# Altium project STM32开发板.PrjPcb
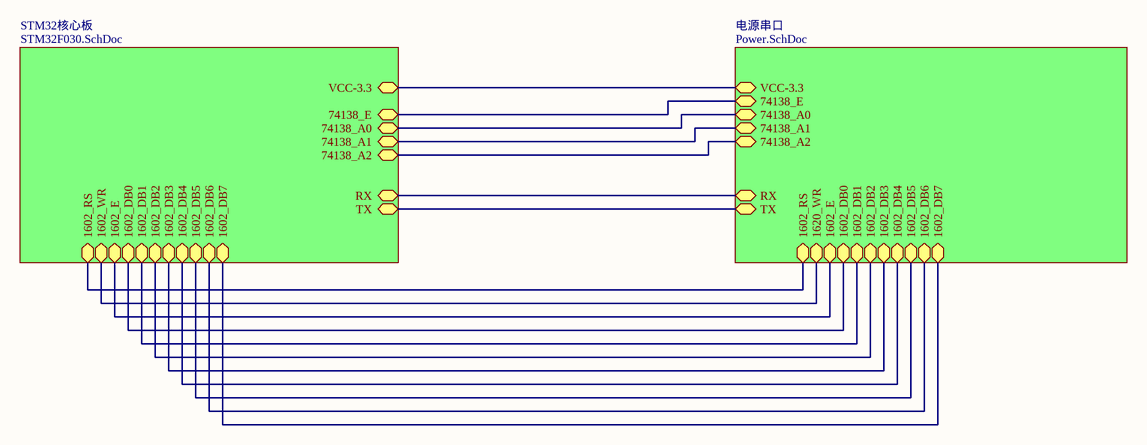
[diagram p0: STM32开发板.SchDoc]
3 sheets, 57 parts. Net scope: hierarchical (ports join the sheet entries above them; power ports are global).
Board file: STM32F030.PcbDoc
Sheets:
  STM32开发板.SchDoc
    STM32核心板 = STM32F030.SchDoc
    电源串口 = Power.SchDoc

## Sheet STM32开发板.SchDoc
size A4

### Sub-sheets
STM32核心板 = STM32F030.SchDoc: VCC-3.3, 74138_E, 74138_A0, 74138_A1, 74138_A2, 1602_RS, 1602_WR, 1602_DB0, 1602_DB1, 1602_DB2, 1602_DB4, 1602_DB5, 1602_DB6, 1602_DB3, 1602_E, 1602_DB7, RX, TX
电源串口 = Power.SchDoc: VCC-3.3, 74138_E, 74138_A0, 74138_A1, 74138_A2, 1602_RS, 1620_WR, 1602_E, 1602_DB0, 1602_DB1, 1602_DB2, 1602_DB3, 1602_DB4, 1602_DB5, 1602_DB6, 1602_DB7, RX, TX

### Nets
MCU_38_A0: sheet STM32核心板/74138_A0, sheet 电源串口/74138_A0
MCU_38_A1: sheet STM32核心板/74138_A1, sheet 电源串口/74138_A1
MCU_38_A2: sheet STM32核心板/74138_A2, sheet 电源串口/74138_A2
MCU_38_E: sheet STM32核心板/74138_E, sheet 电源串口/74138_E
MCU_LCD_DB0: sheet STM32核心板/1602_DB0, sheet 电源串口/1602_DB0
MCU_LCD_DB1: sheet STM32核心板/1602_DB1, sheet 电源串口/1602_DB1
MCU_LCD_DB2: sheet STM32核心板/1602_DB2, sheet 电源串口/1602_DB2
MCU_LCD_DB3: sheet STM32核心板/1602_DB3, sheet 电源串口/1602_DB3
MCU_LCD_DB4: sheet STM32核心板/1602_DB4, sheet 电源串口/1602_DB4
MCU_LCD_DB5: sheet STM32核心板/1602_DB5, sheet 电源串口/1602_DB5
MCU_LCD_DB6: sheet STM32核心板/1602_DB6, sheet 电源串口/1602_DB6
MCU_LCD_DB7: sheet STM32核心板/1602_DB7, sheet 电源串口/1602_DB7
MCU_LCD_E: sheet STM32核心板/1602_E, sheet 电源串口/1602_E
MCU_LCD_RS: sheet STM32核心板/1602_RS, sheet 电源串口/1602_RS
MCU_LCD_WR: sheet STM32核心板/1602_WR, sheet 电源串口/1620_WR
MCU_RXD: sheet STM32核心板/RX, sheet 电源串口/RX
MCU_TXD: sheet STM32核心板/TX, sheet 电源串口/TX
VCC-3.3: sheet STM32核心板/VCC-3.3, sheet 电源串口/VCC-3.3

## Sheet STM32F030.SchDoc
size A4
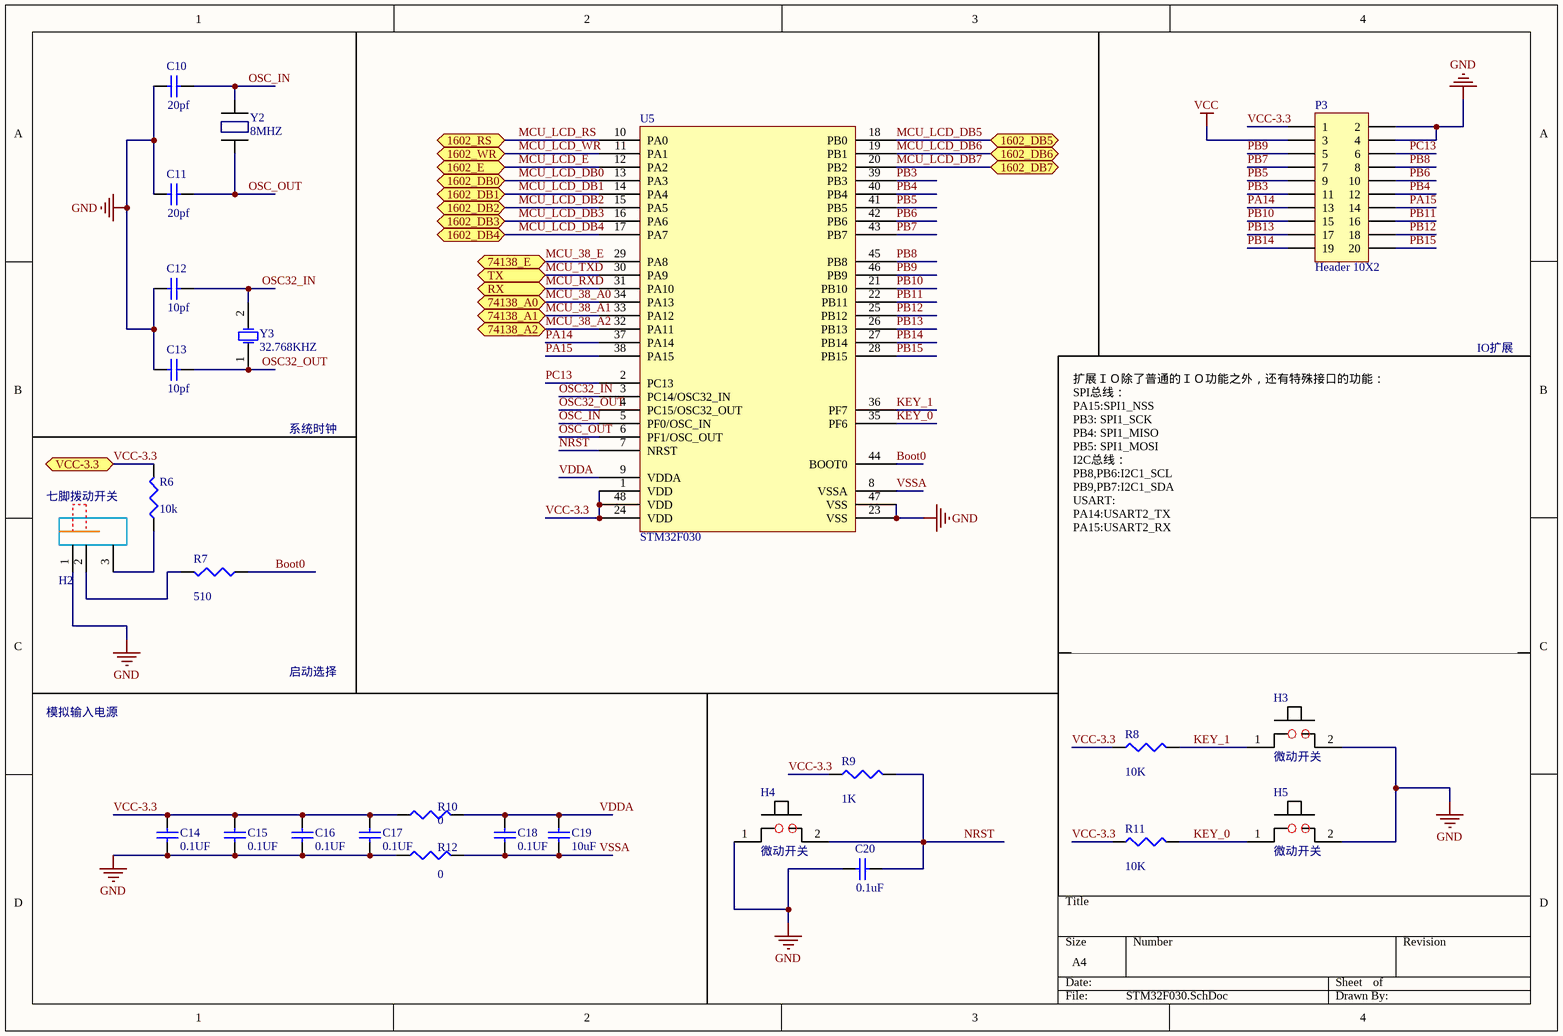
[diagram p1: STM32F030.SchDoc]

### Parts
C10  value 20pf  [C1206]  (hidden comment: Cap Semi)
C11  value 20pf  [C1206]  (hidden comment: Cap Semi)
C12  value 10pf  [C1206]  (hidden comment: Cap Semi)
C13  value 10pf  [C1206]  (hidden comment: Cap Semi)
C14  value 0.1UF  [C1206]  (hidden comment: Cap Semi)
C15  value 0.1UF  [C1206]  (hidden comment: Cap Semi)
C16  value 0.1UF  [C1206]  (hidden comment: Cap Semi)
C17  value 0.1UF  [C1206]  (hidden comment: Cap Semi)
C18  value 0.1UF  [C1206]  (hidden comment: Cap Semi)
C19  value 10uF  [C1206]  (hidden comment: Cap Semi)
C20  value 0.1uF  [C1206]  (hidden comment: Cap Semi)
H2  七脚拨动开关  [七脚拨动开关]
H3  微动开关  [微动开关]
H4  微动开关  [微动开关]
H5  微动开关  [微动开关]
P3  Header 10X2  [HDR2X10]
R6  value 10k  [14-1210]  (hidden comment: Res3)
R7  value 510  [14-1210]  (hidden comment: Res3)
R8  value 10K  [14-1210]  (hidden comment: Res3)
R9  value 1K  [14-1210]  (hidden comment: Res3)
R10  value 0  [14-1210]  (hidden comment: Res3)
R11  value 10K  [14-1210]  (hidden comment: Res3)
R12  value 0  [14-1210]  (hidden comment: Res3)
U5  STM32F030  [TSQFP50P900X900X160-48N]
Y2  8MHZ  [晶振]
Y3  32.768KHZ  [R38]

### Ports
1602_DB0, 1602_DB1, 1602_DB2, 1602_DB3, 1602_DB4, 1602_DB5, 1602_DB6, 1602_DB7, 1602_E, 1602_RS, 1602_WR, 74138_A0, 74138_A1, 74138_A2, 74138_E, RX, TX, VCC-3.3

### Nets
GND: C10.1 C11.1 C12.1 C13.1 C14.1 C15.1 C16.1 C17.1 C20.1 H2.1 H3.2 H4.1 H5.2 P3.2 P3.4 R12.1 U5.23(VSS) U5.47(VSS)
VCC: P3.3  [project net USB-VCC]
Boot0: R7.1 U5.44(BOOT0)
KEY_0: H5.1 R11.2 U5.35(PF6)
KEY_1: H3.1 R8.2 U5.36(PF7)
MCU_38_A0: U5.34(PA13) ; port 74138_A0
MCU_38_A1: U5.33(PA12) ; port 74138_A1
MCU_38_A2: U5.32(PA11) ; port 74138_A2
MCU_38_E: U5.29(PA8) ; port 74138_E
MCU_LCD_DB0: U5.13(PA3) ; port 1602_DB0
MCU_LCD_DB1: U5.14(PA4) ; port 1602_DB1
MCU_LCD_DB2: U5.15(PA5) ; port 1602_DB2
MCU_LCD_DB3: U5.16(PA6) ; port 1602_DB3
MCU_LCD_DB4: U5.17(PA7) ; port 1602_DB4
MCU_LCD_DB5: U5.18(PB0) ; port 1602_DB5
MCU_LCD_DB6: U5.19(PB1) ; port 1602_DB6
MCU_LCD_DB7: U5.20(PB2) ; port 1602_DB7
MCU_LCD_E: U5.12(PA2) ; port 1602_E
MCU_LCD_RS: U5.10(PA0) ; port 1602_RS
MCU_LCD_WR: U5.11(PA1) ; port 1602_WR
MCU_RXD: U5.31(PA10) ; port RX
MCU_TXD: U5.30(PA9) ; port TX
NRST: C20.2 H4.2 R9.2 U5.7(NRST)
OSC32_IN: C12.2 U5.3(PC14/OSC32_IN) Y3.2(OSC2)
OSC32_OUT: C13.2 U5.4(PC15/OSC32_OUT) Y3.1(OSC1)
OSC_IN: C10.2 U5.5(PF0/OSC_IN) Y2.2
OSC_OUT: C11.2 U5.6(PF1/OSC_OUT) Y2.1
PA14: P3.13 U5.37(PA14)
PA15: P3.14 U5.38(PA15)
PB3: P3.11 U5.39(PB3)
PB4: P3.12 U5.40(PB4)
PB5: P3.9 U5.41(PB5)
PB6: P3.10 U5.42(PB6)
PB7: P3.7 U5.43(PB7)
PB8: P3.8 U5.45(PB8)
PB9: P3.5 U5.46(PB9)
PB10: P3.15 U5.21(PB10)
PB11: P3.16 U5.22(PB11)
PB12: P3.18 U5.25(PB12)
PB13: P3.17 U5.26(PB13)
PB14: P3.19 U5.27(PB14)
PB15: P3.20 U5.28(PB15)
PC13: P3.6 U5.2(PC13)
VCC-3.3: C14.2 C15.2 C16.2 C17.2 P3.1 R6.2 R8.1 R9.1 R10.1 R11.1 U5.1(VDD) U5.24(VDD) U5.48(VDD) ; port VCC-3.3
VDDA: C18.2 C19.2 R10.2 U5.9(VDDA)
VSSA: C18.1 C19.1 R12.2 U5.8(VSSA)
NetH2_2: H2.2 R7.2
NetH2_3: H2.3 R6.1

### Notes on the sheet
- IO扩展
- 系统时钟
- 扩展ＩＯ除了普通的ＩＯ功能之外，还有特殊接口的功能：
  SPI总线：
  PA15:SPI1_NSS
  PB3: SPI1_SCK
  PB4: SPI1_MISO
  PB5: SPI1_MOSI
  I2C总线：
  PB8,PB6:I2C1_SCL
  PB9,PB7:I2C1_SDA
  USART:
  PA14:USART2_TX
  PA15:USART2_RX
- 模拟输入电源
- 启动选择

### Library data of the parts
C10-C20 = Cap Semi: Capacitor (Semiconductor SIM Model); Published: 8-Jun-2000; LatestRevisionDate: 29-May-2009; LatestRevisionNote: IPC-7351 Footprint Added.; PackageReference: C1206; Publisher: Altium Limited; PackageDescription: Chip Capacitor
H2 = 七脚拨动开关: H?
H3-H5 = 微动开关: H?
P3 = Header 10X2: Header, 10-Pin, Dual row; LatestRevisionDate: 17-Jul-2002; LatestRevisionNote: Re-released for DXP Platform.; Publisher: Altium Limited
R6-R12 = Res3: Resistor; Published: 8-Jun-2000; LatestRevisionDate: 29-May-2009; LatestRevisionNote: IPC-7351 Footprint Added.; PackageReference: J1-0603; Publisher: Altium Limited; PackageDescription: Chip Resistor
U5 = STM32F030C8T6: U?
Y2 = 晶振: Y?
Y3 = XTAL: Crystal Oscillator; Published: 8-Jun-2000; LatestRevisionDate: 17-Jul-2002; LatestRevisionNote: Re-released for DXP Platform.; PackageReference: R38; Publisher: Altium Limited; PackageDescription: Crystal, Thru-Hole; 2 Leads; Body 3.1 x 8.2 mm (Dia.xH)

## Sheet Power.SchDoc
size A4
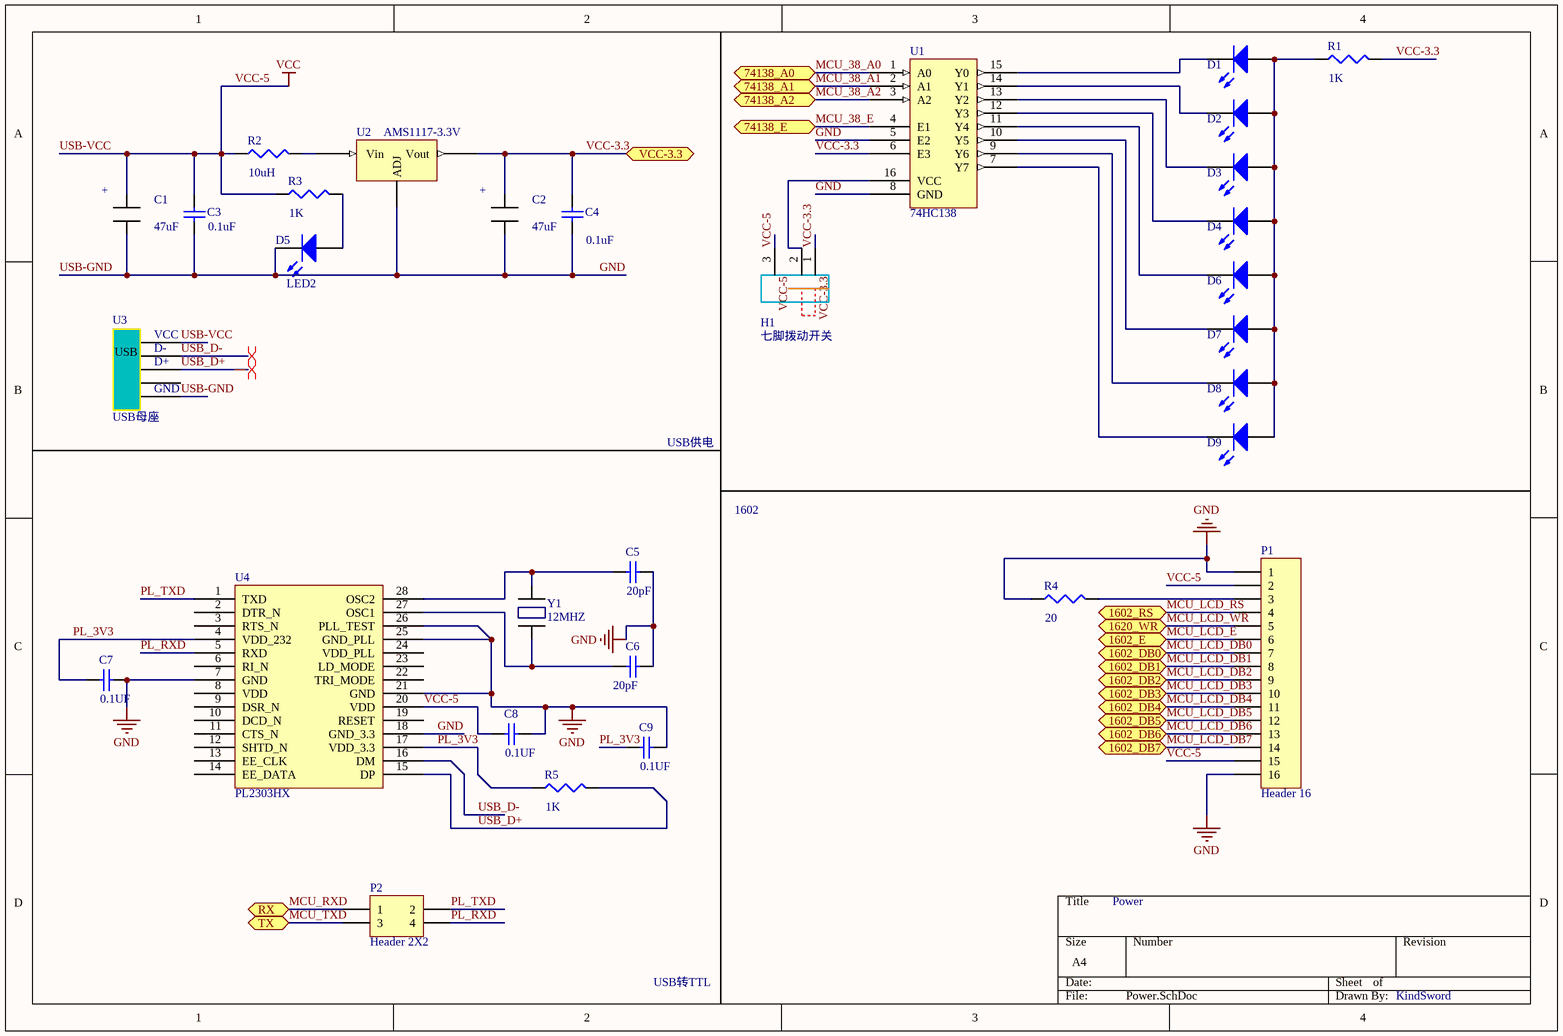
[diagram p2: Power.SchDoc]

### Parts
C1  47uF  [A型坦电容]
C2  47uF  [A型坦电容]
C3  value 0.1uF  [C1206]  (hidden comment: Cap Semi)
C4  value 0.1uF  [C1206]  (hidden comment: Cap Semi)
C5  value 20pF  [C1206]  (hidden comment: Cap Semi)
C6  value 20pF  [C1206]  (hidden comment: Cap Semi)
C7  value 0.1UF  [C1206]  (hidden comment: Cap Semi)
C8  value 0.1UF  [C1206]  (hidden comment: Cap Semi)
C9  value 0.1UF  [C1206]  (hidden comment: Cap Semi)
D1  LED2  [3.2X1.6X1.1]  (value not drawn)
D2  LED2  [3.2X1.6X1.1]  (value not drawn)
D3  LED2  [3.2X1.6X1.1]  (value not drawn)
D4  LED2  [3.2X1.6X1.1]  (value not drawn)
D5  LED2  [3.2X1.6X1.1]
D6  LED1  [3.2X1.6X1.1]  (value not drawn)
D7  LED2  [3.2X1.6X1.1]  (value not drawn)
D8  LED2  [3.2X1.6X1.1]  (value not drawn)
D9  LED2  [3.2X1.6X1.1]  (value not drawn)
H1  七脚拨动开关  [七脚拨动开关]
P1  Header 16  [HDR1X16]
P2  Header 2X2  [HDR2X2]
R1  value 1K  [14-1210]  (hidden comment: Res3)
R2  value 10uH  [14-1210]  (hidden comment: Res3)
R3  value 1K  [14-1210]  (hidden comment: Res3)
R4  value 20  [14-1210]  (hidden comment: Res3)
R5  value 1K  [14-1210]  (hidden comment: Res3)
U1  74HC138  [74HC138]
U2  AMS1117-3.3V  [AMS1117]
U3  USB母座  [MicroUSB母座]
U4  PL2303HX  [PL2303HX]
Y1  12MHZ  [晶振]

### Ports
1602_DB0, 1602_DB1, 1602_DB2, 1602_DB3, 1602_DB4, 1602_DB5, 1602_DB6, 1602_DB7, 1602_E, 1602_RS, 1620_WR, 74138_A0, 74138_A1, 74138_A2, 74138_E, RX, TX, VCC-3.3

### Nets
GND: C1.1(-) C2.1(-) C3.1 C4.1 C5.2 C6.2 C7.2 C8.2 C9.2 D5.2(K) P1.1 P1.16 R4.1 U1.5(E2) U1.8(GND) U2.1(ADJ) U3.5 U4.7(GND) U4.18(GND_3.3) U4.21(GND) U4.25(GND_PLL) U4.26(PLL_TEST)  [also labelled USB-GND]
USB-VCC: C1.2(+) C3.2 C8.1 H1.3 P1.2 P1.15 R2.1 R3.1 U3.1 U4.20(VDD)  [also labelled VCC, VCC-5]
MCU_38_A0: U1.1(A0) ; port 74138_A0
MCU_38_A1: U1.2(A1) ; port 74138_A1
MCU_38_A2: U1.3(A2) ; port 74138_A2
MCU_38_E: U1.4(E1) ; port 74138_E
MCU_LCD_DB0: P1.7 ; port 1602_DB0
MCU_LCD_DB1: P1.8 ; port 1602_DB1
MCU_LCD_DB2: P1.9 ; port 1602_DB2
MCU_LCD_DB3: P1.10 ; port 1602_DB3
MCU_LCD_DB4: P1.11 ; port 1602_DB4
MCU_LCD_DB5: P1.12 ; port 1602_DB5
MCU_LCD_DB6: P1.13 ; port 1602_DB6
MCU_LCD_DB7: P1.14 ; port 1602_DB7
MCU_LCD_E: P1.6 ; port 1602_E
MCU_LCD_RS: P1.4 ; port 1602_RS
MCU_LCD_WR: P1.5 ; port 1620_WR
MCU_RXD: P2.1 ; port RX
MCU_TXD: P2.3 ; port TX
PL_3V3: C7.1 C9.1 R5.1 U4.4(VDD_232) U4.17(VDD_3.3)
PL_RXD: P2.4 U4.5(RXD)
PL_TXD: P2.2 U4.1(TXD)
USB_D+: R5.2 U3.3 U4.15(DP)
USB_D-: U3.2 U4.16(DM)
VCC-3.3: C2.2(+) C4.2 H1.1 R1.2 U1.6(E3) U2.2(Vout) ; port VCC-3.3
NetC5_1: C5.1 U4.28(OSC2) Y1.2
NetC6_1: C6.1 U4.27(OSC1) Y1.1
NetD1_1: D1.1(A) D2.1(A) D3.1(A) D4.1(A) D6.1(A) D7.1(A) D8.1(A) D9.1(A) R1.1
NetD1_2: D1.2(K) U1.15(Y0)
NetD2_2: D2.2(K) U1.14(Y1)
NetD3_2: D3.2(K) U1.13(Y2)
NetD4_2: D4.2(K) U1.12(Y3)
NetD5_1: D5.1(A) R3.2
NetD6_2: D6.2(K) U1.11(Y4)
NetD7_2: D7.2(K) U1.10(Y5)
NetD8_2: D8.2(K) U1.9(Y6)
NetD9_2: D9.2(K) U1.7(Y7)
NetH1_2: H1.2 U1.16(VCC)
NetP1_3: P1.3 R4.2
NetR2_2: R2.2 U2.3(Vin)

Not connected (* = marked no-connect by the designer): U3 4; U4 2(DTR_N) 3(RTS_N) 6(RI_N) 8(VDD) 9(DSR_N) 10(DCD_N) 11(CTS_N) 12(SHTD_N) 13(EE_CLK) 14(EE_DATA) 19(RESET) 22(TRI_MODE) 23(LD_MODE) 24(VDD_PLL)

### Layout directives
differential pair: USB_D+, USB_D-

### Notes on the sheet
- USB供电
- 1602
- Power
- USB转TTL
- KindSword
- Labels drawn without touching a wire or pin: VCC-3.3, VCC-5
- (in symbol MicroUSB母座) VCC; D-; D+; GND; / USB /

### Library data of the parts
C1 C2 = A型坦电容: pin to pad: 1>0 2>1
C3-C9 = Cap Semi: Capacitor (Semiconductor SIM Model); Published: 8-Jun-2000; LatestRevisionDate: 29-May-2009; LatestRevisionNote: IPC-7351 Footprint Added.; PackageReference: C1206; Publisher: Altium Limited; PackageDescription: Chip Capacitor
D1-D9 = LED2: Typical RED, GREEN, YELLOW, AMBER GaAs LED; Published: 8-Jun-2000; LatestRevisionDate: 17-Jul-2002; LatestRevisionNote: Re-released for DXP Platform.; PackageVersion: Feb-2002; PackageReference: 3.2X1.6X1.1; Publisher: Altium Limited; PackageDescription: SM LED; 2 Flat Leads
H1 = 七脚拨动开关: H?
P1 = Header 16: Header, 16-Pin; LatestRevisionDate: 17-Jul-2002; LatestRevisionNote: Re-released for DXP Platform.; Publisher: Altium Limited
P2 = Header 2X2: Header, 2-Pin, Dual row; LatestRevisionDate: 17-Jul-2002; LatestRevisionNote: Re-released for DXP Platform.; Publisher: Altium Limited
R1-R5 = Res3: Resistor; Published: 8-Jun-2000; LatestRevisionDate: 29-May-2009; LatestRevisionNote: IPC-7351 Footprint Added.; PackageReference: J1-0603; Publisher: Altium Limited; PackageDescription: Chip Resistor
U2 = AMS1117
U3 = MicroUSB母座: U?
Y1 = 晶振: Y?

## Nets that join several sheets
GND: STM32F030 (18 pins), Power (22 pins)
USB-VCC: STM32F030 (P3.3), Power (10 pins)
MCU_38_A0: STM32F030 (U5.34), Power (U1.1)
MCU_38_A1: STM32F030 (U5.33), Power (U1.2)
MCU_38_A2: STM32F030 (U5.32), Power (U1.3)
MCU_38_E: STM32F030 (U5.29), Power (U1.4)
MCU_LCD_DB0: STM32F030 (U5.13), Power (P1.7)
MCU_LCD_DB1: STM32F030 (U5.14), Power (P1.8)
MCU_LCD_DB2: STM32F030 (U5.15), Power (P1.9)
MCU_LCD_DB3: STM32F030 (U5.16), Power (P1.10)
MCU_LCD_DB4: STM32F030 (U5.17), Power (P1.11)
MCU_LCD_DB5: STM32F030 (U5.18), Power (P1.12)
MCU_LCD_DB6: STM32F030 (U5.19), Power (P1.13)
MCU_LCD_DB7: STM32F030 (U5.20), Power (P1.14)
MCU_LCD_E: STM32F030 (U5.12), Power (P1.6)
MCU_LCD_RS: STM32F030 (U5.10), Power (P1.4)
MCU_LCD_WR: STM32F030 (U5.11), Power (P1.5)
MCU_RXD: STM32F030 (U5.31), Power (P2.1)
MCU_TXD: STM32F030 (U5.30), Power (P2.3)
VCC-3.3: STM32F030 (13 pins), Power (6 pins)